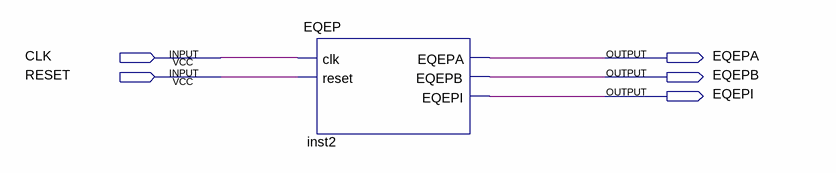
[diagram p0: schematic sheet]
// Quartus schematic EQEP_test.bdf as structural Verilog: 1 symbols, 5 pins
module EQEP_test (
  input  CLK,
  input  RESET,
  output EQEPA,
  output EQEPB,
  output EQEPI
);

  EQEP inst2 (.clk(CLK), .reset(RESET), .EQEPA(EQEPA), .EQEPB(EQEPB), .EQEPI(EQEPI));
endmodule
